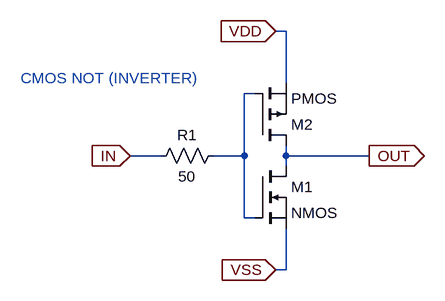
[diagram p0: schematic NOT.asc]
NOT.asc, the LTspice schematic file:
Version 4
SHEET 1 880 680
WIRE 288 -64 272 -64
WIRE 288 16 288 -64
WIRE 240 32 224 32
WIRE 96 128 48 128
WIRE 224 128 224 32
WIRE 224 128 176 128
WIRE 288 128 288 112
WIRE 416 128 288 128
WIRE 288 144 288 128
WIRE 224 224 224 128
WIRE 240 224 224 224
WIRE 288 304 288 240
WIRE 288 304 272 304
FLAG 48 128 IN
IOPIN 48 128 In
FLAG 272 304 VSS
IOPIN 272 304 In
FLAG 272 -64 VDD
IOPIN 272 -64 In
FLAG 416 128 OUT
IOPIN 416 128 Out
SYMBOL nmos 240 144 R0
SYMATTR InstName M1
SYMBOL pmos 240 112 M180
SYMATTR InstName M2
SYMBOL res 192 112 R90
WINDOW 0 0 56 VBottom 2
WINDOW 3 32 56 VTop 2
SYMATTR InstName R1
SYMATTR Value 50
TEXT -120 8 Left 2 ;CMOS NOT (INVERTER)

The netlist it stands for:
* NOT.asc
M1 OUT N001 VSS VSS NMOS
M2 OUT N001 VDD VDD PMOS
R1 N001 IN 50
.model NMOS NMOS
.model PMOS PMOS
.lib standard.mos
* CMOS NOT (INVERTER)
.backanno
.end